# EasyEDA schematic SCH_SmartElectricFreqMonitor_2022-03-12.json
TITLE: Sheet_1; REV: 1.0; Date: 2022-03-12; Sheet: 1/1; Drawn By: naumanshakir; Company: Your Company
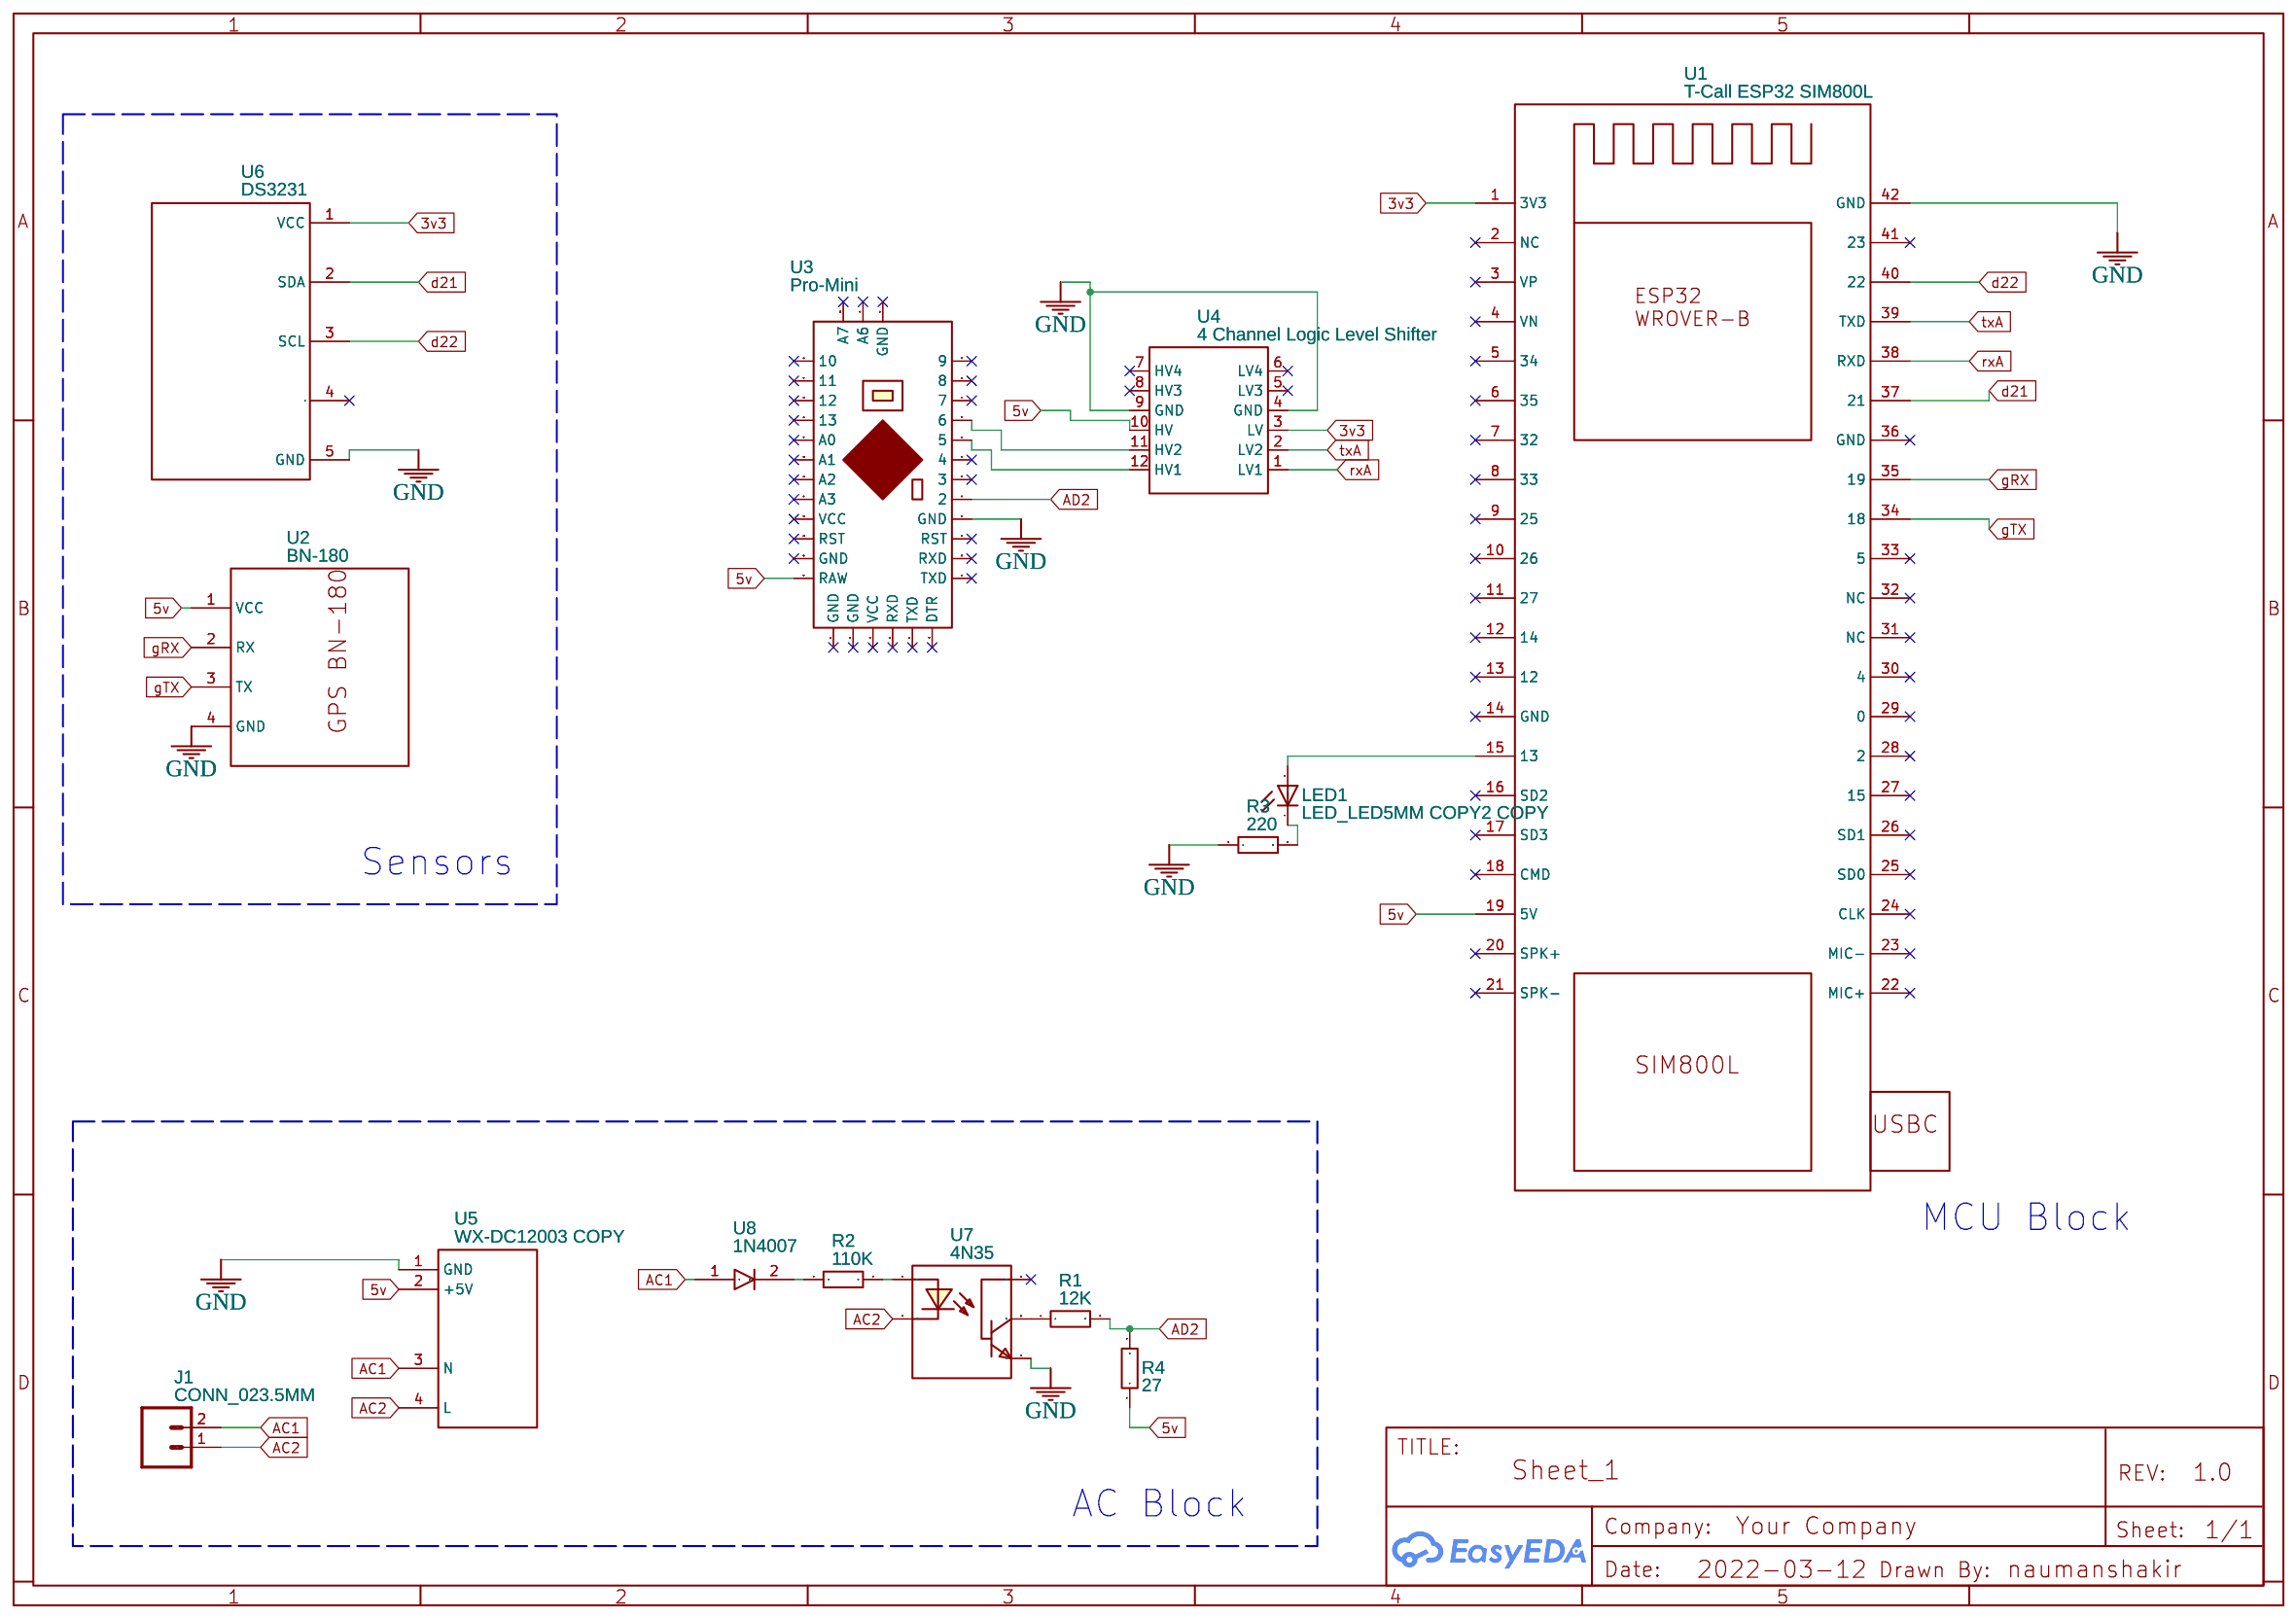
[diagram p0: schematic sheet]

## Parts
J1  CONN_023.5MM  [SCREWTERMINAL-3.5MM-2]
LED1  LED_LED5MM COPY2 COPY  [LED_LED5MM]
R1  12K  [RES-TH_BD4.0-L10.5-P14.50-D0.6]
R2  110K  [RES-TH_BD2.2-L6.5-P10.50-D0.6]
R3  220  [RES-TH_BD3.3-L9.0-P13.00-D0.6]
R4  27  [RES-TH_BD4.0-L10.5-P14.50-D0.6]
U1  T-Call ESP32 SIM800L  [T-CALL ESP32 SIM800L]
U2  BN-180  [GPS BN-180 BEITIAN]
U3  Pro-Mini  [ARDUINO-PRO-MINI-NOPROGCONN_AK]
U4  4 Channel Logic Level Shifter  [4 CHANNEL LOGIC LEVEL SHIFTER]
U5  WX-DC12003 COPY  [WX-DC12003]
U6  DS3231  [DS3231_PI]
U7  4N35  [4N35]
U8  1N4007  [1N4007]

## Library data of the parts
J1 = CONN_023.5MM: Contributor: akshay b
LED1 = LED_LED5MM COPY2 COPY: LED
R1 = RD50T5123J: Supplier: LCSC; Supplier Part: C167534; Manufacturer: TA-I Tech; Contributor: LCSC; JLCPCB Part Class: Extended Part; Resistance: 12kΩ
R2 = CF1/4W-110KΩ±5% T52: Supplier: LCSC; Supplier Part: C120104; Manufacturer: Chian Chia Elec; Contributor: LCSC; Resistance: 110kΩ
R3 = RD50T5221J: Supplier: LCSC; Supplier Part: C167559; Manufacturer: TA-I Tech; Contributor: LCSC; JLCPCB Part Class: Extended Part; Resistance: 220Ω
R4 = RD50T5270J: Supplier: LCSC; Supplier Part: C167567; Manufacturer: TA-I Tech; Contributor: LCSC; JLCPCB Part Class: Extended Part; Resistance: 27Ω
U1 = T-Call ESP32 SIM800L: Manufacturer: T-Call; Supplier: LCSC; Supplier Part: ESP32 SIM800L; link: https://raw.githubusercontent.com/Xinyuan-LilyGO/TTGO-T-Call/master/datasheet/T-Call.jpg; Contributor: adntdream
U2 = BN-180: Contributor: RamonRamones
U3 = Pro-Mini: Contributor: andrej.kanovsky
U4 = 4 Channel Logic Level Shifter
U5 = WX-DC12003 COPY: Contributor: stopka
U6 = DS3231: Manufacturer Part: New SchematicLib; Contributor: rajmqtt
U7 = 4N35: Manufacturer: EVERLIGHT; image: //image.lceda.cn/szlcsc/C57084.jpg; Supplier Part: C57084; Contributor: SIIISSIIIS
U8 = 1N4007: Contributor: Hotte

## Nets
3v3: U1.1(3V3) U4.3(LV) U6.1(VCC)
5v: R4.1 U1.19(5V) U2.1(VCC) U3.21(RAW) U4.10(HV) U5.2(+5V)
GND: R3.1 U1.42(GND) U2.4(GND) U3.23(GND) U4.4(GND) U4.9(GND) U5.1(GND) U6.5(GND) U7.4
AC1: J1.2 U5.3(N) U8.1
AC2: J1.1 U5.4(L) U7.2
AD2: R1.2 R4.2 U3.2
d21: U1.37(21) U6.2(SDA)
d22: U1.40(22) U6.3(SCL)
gRX: U1.35(19) U2.2(RX)
gTX: U1.34(18) U2.3(TX)
rxA: U1.38(RXD) U4.1(LV1)
txA: U1.39(TXD) U4.2(LV2)
Net-(LED1-A): LED1.A U1.15(13)
Net-(LED1-K): LED1.K(C) R3.2
Net-(R1-1): R1.1 U7.5
Net-(R2-1): R2.1 U8.2
Net-(R2-2): R2.2 U7.1
Net-(U3-5): U3.5 U4.12(HV1)
Net-(U3-6): U3.6 U4.11(HV2)

Not connected (* = marked no-connect by the designer): U1 2(NC)* 3(VP)* 4(VN)* 5(34)* 6(35)* 7(32)* 8(33)* 9(25)* 10(26)* 11(27)* 12(14)* 13(12)* 14(GND)* 16(SD2)* 17(SD3)* 18(CMD)* 20(SPK+)* 21(SPK-)* 22(MIC+)* 23(MIC-)* 24(CLK)* 25(SD0)* 26(SD1)* 27(15)* 28(2)* 29(0)* 30(4)* 31(NC)* 32(NC)* 33(5)* 36(GND)* 41(23)*; U3 0(RXD)* 1(TXD)* 3* 4* 7* 8* 9* 10* 11* 12* 13* 14(A0)* 15(A1)* 16(A2)* 17(A3)* 18(VCC)* 19(RST)* 20(GND)* 22(RST)* 24(GND)* 27(A6)* 28(A7)* 30(DTR)* 31(TXD)* 32(RXD)* 33(VCC)* 34(GND)* 35(GND)*; U4 5(LV3)* 6(LV4)* 7(HV4)* 8(HV3)*; U6 4*; U7 6*

## Notes on the sheet
- Sensors
- MCU Block
- AC Block
